# Altium schematic sheet Relay schematic.SchDoc
size A4; Date: 24/10; Author: Rami Abdelmotalib; DocumentName: Relay circuit
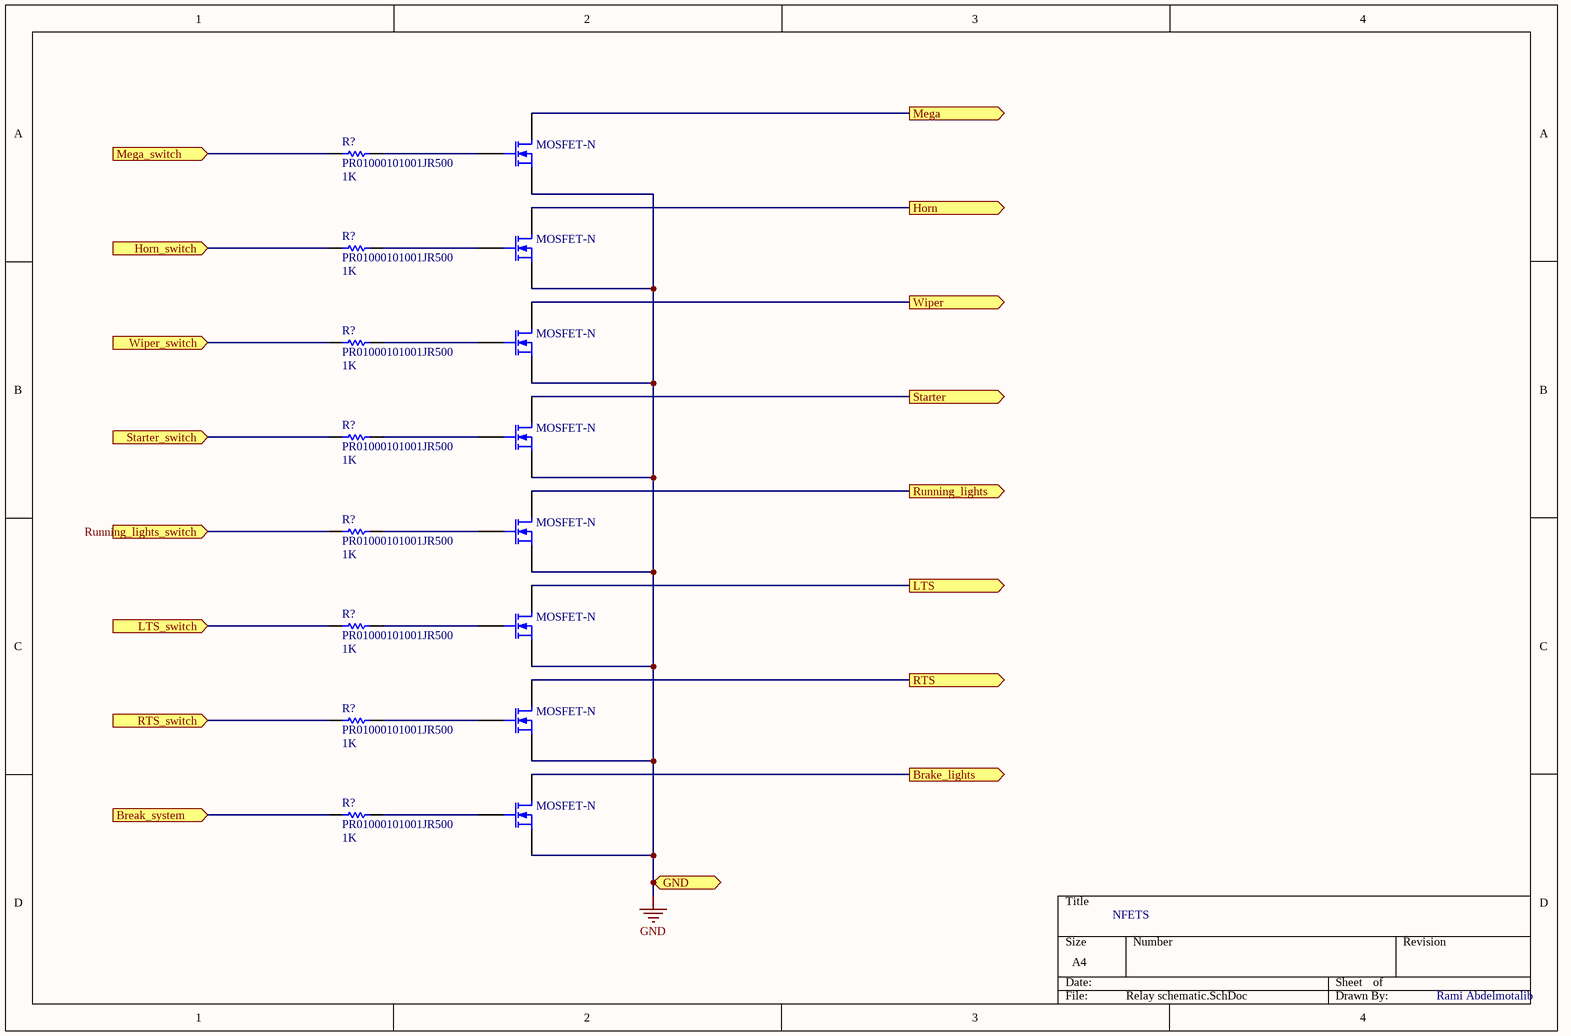
[diagram p0: Relay schematic.SchDoc]

## Parts
(Parts that share a designator on the sheet are numbered #1, #2 ... from top to bottom, then left to right.)
MOSFET-N#1  (no value)  [D2pakMOSFET]
MOSFET-N#2  (no value)  [D2pakMOSFET]
MOSFET-N#3  (no value)  [D2pakMOSFET]
MOSFET-N#4  (no value)  [D2pakMOSFET]
MOSFET-N#5  (no value)  [D2pakMOSFET]
MOSFET-N#6  (no value)  [D2pakMOSFET]
MOSFET-N#7  (no value)  [D2pakMOSFET]
MOSFET-N#8  (no value)  [D2pakMOSFET]
R?#1  PR01000101001JR500  value 1K  [AXIAL-0.3]
R?#2  PR01000101001JR500  value 1K  [AXIAL-0.3]
R?#3  PR01000101001JR500  value 1K  [AXIAL-0.3]
R?#4  PR01000101001JR500  value 1K  [AXIAL-0.3]
R?#5  PR01000101001JR500  value 1K  [AXIAL-0.3]
R?#6  PR01000101001JR500  value 1K  [AXIAL-0.3]
R?#7  PR01000101001JR500  value 1K  [AXIAL-0.3]
R?#8  PR01000101001JR500  value 1K  [AXIAL-0.3]

## Ports
Brake_lights (out), Break_system (in), GND, Horn (out), Horn_switch (in), LTS (out), LTS_switch (in), Mega (out), Mega_switch (in), RTS (out), RTS_switch (in), Running_lights (out), Running_lights_switch (in), Starter (out), Starter_switch (in), Wiper (out), Wiper_switch (in)

## Nets
GND: MOSFET-N#1.3(S) MOSFET-N#2.3(S) MOSFET-N#3.3(S) MOSFET-N#4.3(S) MOSFET-N#5.3(S) MOSFET-N#6.3(S) MOSFET-N#7.3(S) MOSFET-N#8.3(S) ; port GND
Brake_lights: MOSFET-N#8.1(D) ; port Brake_lights
Break_system: R?#8.1 ; port Break_system
Horn: MOSFET-N#2.1(D) ; port Horn
Horn_switch: R?#2.1 ; port Horn_switch
LTS: MOSFET-N#6.1(D) ; port LTS
LTS_switch: R?#6.1 ; port LTS_switch
Mega: MOSFET-N#1.1(D) ; port Mega
Mega_switch: R?#1.1 ; port Mega_switch
RTS: MOSFET-N#7.1(D) ; port RTS
RTS_switch: R?#7.1 ; port RTS_switch
Running_lights: MOSFET-N#5.1(D) ; port Running_lights
Running_lights_switch: R?#5.1 ; port Running_lights_switch
Starter: MOSFET-N#4.1(D) ; port Starter
Starter_switch: R?#4.1 ; port Starter_switch
Wiper: MOSFET-N#3.1(D) ; port Wiper
Wiper_switch: R?#3.1 ; port Wiper_switch
NetMOSFET-N#1_2: MOSFET-N#1.2(G) R?#1.2
NetMOSFET-N#2_2: MOSFET-N#2.2(G) R?#2.2
NetMOSFET-N#3_2: MOSFET-N#3.2(G) R?#3.2
NetMOSFET-N#4_2: MOSFET-N#4.2(G) R?#4.2
NetMOSFET-N#5_2: MOSFET-N#5.2(G) R?#5.2
NetMOSFET-N#6_2: MOSFET-N#6.2(G) R?#6.2
NetMOSFET-N#7_2: MOSFET-N#7.2(G) R?#7.2
NetMOSFET-N#8_2: MOSFET-N#8.2(G) R?#8.2

## Notes on the sheet
- NFETS
- Rami Abdelmotalib

## Library data of the parts
MOSFET-N#1-MOSFET-N#8 = MOSFET-N: N-Channel MOSFET; Published: 8-Jun-2000; LatestRevisionDate: 17-Jul-2002; LatestRevisionNote: Re-released for DXP Platform.; PackageVersion: 1995/1996; PackageReference: E3; Publisher: Altium Limited; PackageDescription: TO, Flat Index; 3 In-Line, Axial Leads; Body Dia. 4.6mm; Lead Dia. 0.5 mm (max)
R?#1-R?#8 = Res1: Resistor; Published: 8-Jun-2000; LatestRevisionDate: 17-Jul-2002; LatestRevisionNote: Re-released for DXP Platform.; PackageReference: AXIAL-0.3; Publisher: Altium Limited; PackageDescription: Axial Device, Thru-Hole; 2 Leads; 0.3 in Pin Spacing